# Altium schematic sheet MIRA016-CSP-Sheet1.SchDoc: MIRA016 CSP
size A3; Date: 15-Jun-2023; CheckedBy: -not-used-; Author: -not-used-; CompanyName: AMS; DrawnBy: -not-used-; Engineer: MKOC; Organization: AMS; Address1: Borsbeeksebrug 36; Address2: 2600 Antwerpen; Address3: Belgium; Address4: T: +32 3 260 1730 | F: +32 3 260 1779; Revision: 1.0; SheetNumber: 1; SheetTotal: 1; PageSetup: Record=PageOptions|CenterHorizontal=True|CenterVertical=True|PrintScale=0.71|XCorrection=1.00|YCorrection=1.00|PrintKind=0|BorderSize=5000000|LeftOffset=0|BottomOffset=0|Orientation=2|PaperLength=1000|PaperWidth=1000|Scale=100|PaperSource=7|PrintQuality=-4|MediaType=1|DitherType=10|PrintScaleMode=1|PaperKind=A4|PaperIndex=9; Comment1: Reference Design; Project: MIRA016; ProjectName: -not-used-; Rule: PcbType=ProtelPcb
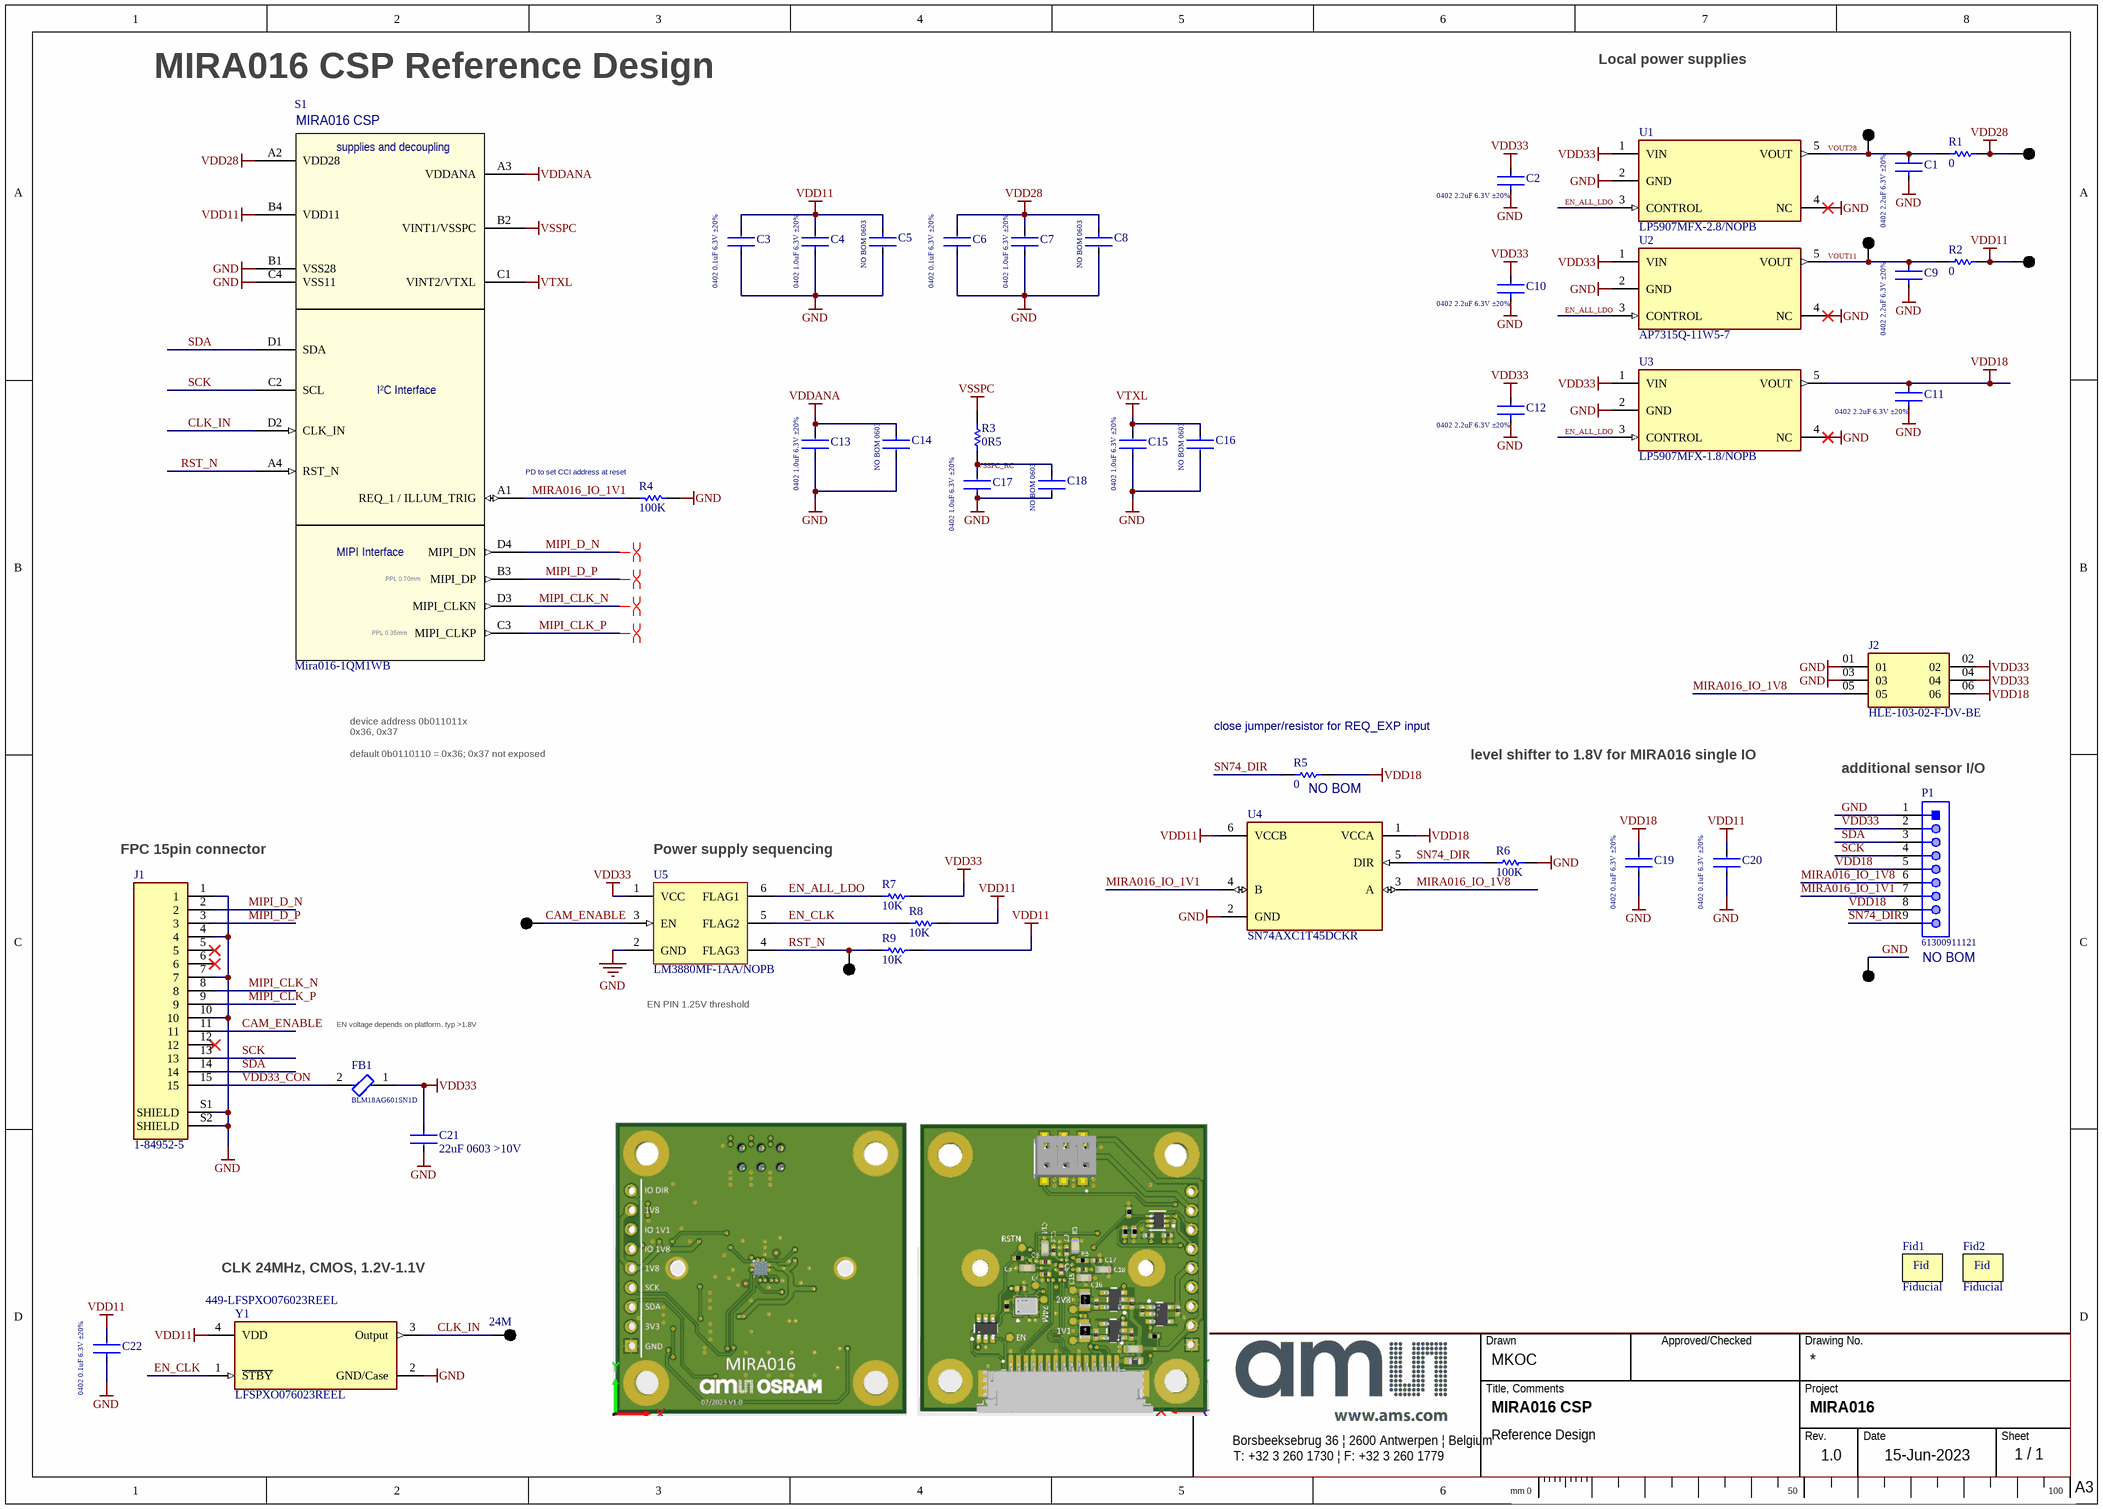
[diagram p0: MIRA016-CSP-Sheet1.SchDoc]

## Parts
C1  0402 2.2uF 6.3V ±20%  [CAPC0402_N]
C2  0402 2.2uF 6.3V ±20%  [CAPC0402_N]
C3  0402 0.1uF 6.3V ±20%  [CAPC0402_N]
C4  0402 1.0uF 6.3V ±20%  [CAPC0402_N]
C5  NO BOM 0603  [CAPC0603_L]  (no BOM)
C6  0402 0.1uF 6.3V ±20%  [CAPC0402_N]
C7  0402 1.0uF 6.3V ±20%  [CAPC0402_N]
C8  NO BOM 0603  [CAPC0603_L]  (no BOM)
C9  0402 2.2uF 6.3V ±20%  [CAPC0402_N]
C10  0402 2.2uF 6.3V ±20%  [CAPC0402_N]
C11  0402 2.2uF 6.3V ±20%  [CAPC0402_N]
C12  0402 2.2uF 6.3V ±20%  [CAPC0402_N]
C13  0402 1.0uF 6.3V ±20%  [CAPC0402_N]
C14  NO BOM 0603  [CAPC0603_L]  (no BOM)
C15  0402 1.0uF 6.3V ±20%  [CAPC0402_N]
C16  NO BOM 0603  [CAPC0603_L]  (no BOM)
C17  0402 1.0uF 6.3V ±20%  [CAPC0402_N]
C18  NO BOM 0603  [CAPC0603_L]  (no BOM)
C19  0402 0.1uF 6.3V ±20%  [CAPC0402_N]
C20  0402 0.1uF 6.3V ±20%  [CAPC0402_N]
C21  22uF 0603 >10V  [CAPC0603]
C22  0402 0.1uF 6.3V ±20%  [CAPC0402_N]
FB1  BLM18AG601SN1D  [FP-BLM18-0_15-t0_8-IPC_B]
Fid1  Fiducial  [Fiducial]  (no BOM)
Fid2  Fiducial  [Fiducial]  (no BOM)
J1  1-84952-5  [TE_1-84952-5]
J2  HLE-103-02-F-DV-BE  [SAMTEC_HLE-103-02-F-DV-BE]
P1  61300911121  [61300911121]  (no BOM)
R1  0  [RESC0805_N]
R2  0  [RESC0805_N]
R3  0R5  [RESC0402_N]
R4  100K  [RESC0402_N]
R5  0  [RESC0402_N]  (no BOM)
R6  100K  [RESC0402_N]
R7  10K  [RESC0402_N]
R8  10K  [RESC0402_N]
R9  10K  [RESC0402_N]
S1  Mira016-1QM1WB  [MIRA016CSP]
TP1  2V8  [TP_1mm]  (value not drawn)  (no BOM)
TP2  2V8  [TP_1mm]  (value not drawn)  (no BOM)
TP3  1V1  [TP_1mm]  (value not drawn)  (no BOM)
TP4  1V1  [TP_1mm]  (value not drawn)  (no BOM)
TP6  EN  [TP_1mm]  (value not drawn)  (no BOM)
TP7  RSTN  [TP_1mm]  (value not drawn)  (no BOM)
TP8  GND  [TP_1mm]  (value not drawn)  (no BOM)
TP9  24M  [TP_1mm]  (no BOM)
U1  LP5907MFX-2.8/NOPB  [FP-DBV0005A-MFG]
U2  AP7315Q-11W5-7  [FP-DBV0005A-MFG]
U3  LP5907MFX-1.8/NOPB  [FP-DBV0005A-MFG]
U4  SN74AXC1T45DCKR  [FP-DCK0006A-IPC_B]
U5  LM3880MF-1AA/NOPB  [DBV0006A_N]
Y1  LFSPXO076023REEL  Supplier Part Number 1: 449-LFSPXO076023REEL  [FP-ASE-MFG]

## Nets
GND: C1.1 C2.1 C3.1 C4.1 C5.2 C6.1 C7.1 C8.2 C9.1 C10.1 C11.1 C12.1 C13.1 C14.2 C15.1 C16.2 C17.1 C18.2 C19.1 C20.1 C21.2 C22.1 J1.1 J1.4 J1.7 J1.10 J1.S1(SHIELD) J1.S2(SHIELD) J2.01 J2.03 P1.1 R4.1 R6.1 S1.B1(VSS28) S1.C4(VSS11) TP8.1 U1.2(GND) U1.4(NC) U2.2(GND) U2.4(NC) U3.2(GND) U3.4(NC) U4.2(GND) U5.2(GND) Y1.2(GND/Case)
VDD11: C3.2 C4.2 C5.1 C20.2 C22.2 R2.1 R8.2 R9.2 S1.B4(VDD11) TP4.1 U4.6(VCCB) Y1.4(VDD)
VDD18: C11.2 C19.2 J2.06 P1.5 P1.8 R5.2 U3.5(VOUT) U4.1(VCCA)
VDD28: C6.2 C7.2 C8.1 R1.1 S1.A2(VDD28) TP2.1
VDD33: C2.2 C10.2 C12.2 C21.1 FB1.1 J2.02 J2.04 P1.2 R7.2 U1.1(VIN) U2.1(VIN) U3.1(VIN) U5.1(VCC)
VDDANA: C13.2 C14.1 S1.A3(VDDANA)
VSSPC: R3.2 S1.B2(VINT1/VSSPC)
VTXL: C15.2 C16.1 S1.C1(VINT2/VTXL)
CAM_ENABLE: J1.11 TP6.1 U5.3(EN)
CLK_IN: S1.D2(CLK_IN) TP9.1 Y1.3(Output)
EN_ALL_LDO: R7.1 U1.3(CONTROL) U2.3(CONTROL) U3.3(CONTROL) U5.6(FLAG1)
EN_CLK: R8.1 U5.5(FLAG2) Y1.1(~{STBY})
MIPI_CLK_N: J1.8 S1.D3(MIPI_CLKN)
MIPI_CLK_P: J1.9 S1.C3(MIPI_CLKP)
MIPI_D_N: J1.2 S1.D4(MIPI_DN)
MIPI_D_P: J1.3 S1.B3(MIPI_DP)
MIRA016_IO_1V1: P1.7 R4.2 S1.A1(REQ_1_/_ILLUM_TRIG) U4.4(B)
MIRA016_IO_1V8: J2.05 P1.6 U4.3(A)
RST_N: R9.1 S1.A4(RST_N) TP7.1 U5.4(FLAG3)
SCK: J1.13 P1.4 S1.C2(SCL)
SDA: J1.14 P1.3 S1.D1(SDA)
SN74_DIR: P1.9 R5.1 R6.2 U4.5(DIR)
VDD33_CON: FB1.2 J1.15
VOUT11: C9.2 R2.2 TP3.1 U2.5(VOUT)
VOUT28: C1.2 R1.2 TP1.1 U1.5(VOUT)
VSSPC_RC: C17.2 C18.1 R3.1

Not connected (* = marked no-connect by the designer): J1 5* 6* 12*

## Layout directives
differential pair: MIPI_CLK_N, MIPI_CLK_P, MIPI_D_N, MIPI_D_P

## Notes on the sheet
- MIRA016 CSP Reference Design
- Local power supplies
- (near R4) PD to set CCI address at reset
- device address 0b011011x
  0x36, 0x37
  default 0b0110110 = 0x36; 0x37 not exposed
- (near R5) close jumper/resistor for REQ_EXP input
- (near R5) NO BOM
- level shifter to 1.8V for MIRA016 single IO
- (near P1) additional sensor I/O
- (near J1) FPC 15pin connector
- (near U5) Power supply sequencing
- (near P1) NO BOM
- EN voltage depends on platform. typ >1.8V
- (near U5) EN PIN 1.25V threshold
- CLK 24MHz, CMOS, 1.2V-1.1V
- Title, Comments
- Drawn
- Approved/Checked
- Drawing No.
- Project
- Borsbeeksebrug 36 | 2600 Antwerpen | Belgium
- T: +32 3 260 1730 | F: +32 3 260 1779
- Rev.
- Date
- Sheet
- mm 0
- 50
- 100
- A3
- (in symbol Fiducial) Fid
- (in symbol MIRA016CSP) supplies and decoupling; I²C Interface; MIPI Interface; PPL 0.70mm; PPL 0.35mm

## Library data of the parts
C1 C2 C9-C12 = CAP0201: 0402 2.20uF 6.3V ±20%
C3 C4 C6 C7 C13 C15 C17 C19 C20 C22 = CAP0201
C5 C8 C14 C16 C18 = CAP0201: spare cap 0603; Case Code (Imperial): 0201; Case/Package: 0201
C21 = CAP0201: Chip Multilayer Ceramic Capacitors for General Purpose, 0603, 22uF, X5R, 15%, 10%, 25V; Case Code (Imperial): 0201; Case/Package: 0201
FB1 = CMP-0686-00436-3: Chip Ferrite Bead, 0603, 600Ω @ 100MHz, 0.38Ω, 25%, 500mA; Number of Lines: 1; Impedance: 600R; DC Resistance (DCR): 380mR; Material: Steel; Shielding: Unshielded; Max DC Current: 500mA; Termination: SMD/SMT; Military Standard: Not; Number of Circuits: 1; Min Operating Temperature: -55°C; Case Code (Imperial): 0603; Width: 0.8mm; Current Rating: 500mA; Lead Free: Lead Free; Packaging: Tape and Reel; Frequency: 100MHz; Max Operating Temperature: 125°C; DC Current: 500mA; REACH SVHC: No SVHC; Case/Package: 0603; Package Quantity: 1; Height: 0.8mm; Number of Pins: 2; Depth: 0.8mm; Test Frequency: 100MHz; Case Code (Metric): 1608; Tolerance: 25%; Core Material: Ferrite; Weight: 7.1E-05oz; Max Current Rating: 500mA; Radiation Hardening: No; Length: 1.6mm; RoHS Compliant: Yes
Fid1 Fid2 = Fiducial: Alignment feature for PCB Assembly; Part Number: NA; Designator: Fid?; Component: Fiducial; Componenttype: Fiducial
J1 = 1-84952-5: Conn FPC Connector SKT 15 POS 1mm Solder RA SMD T/R; Part Number: 1-84952-5
J2 = HLE-103-02-F-DV-BE: MF: Samtec; Value: *; Availability: Unavailable; Price: None; Package: None; MP: HLE-103-02-F-DV-BE
P1 = CMP-1502-01080-1: THT Vertical Pin Header WR-PHD, Pitch 2.54 mm, Single Row, 9 pins; Manufacturer: Wurth Elektronik; Pitch: 2.54mm; Gender: Male; Working Voltage: 250VAC; Contact Resistance: 20mOhm; Withstanding Voltage: 500VAC; Pin Number: 9; Rated Current: 3A; Package Reference: 61300911121; Part Number: 61300911121; Mounting Technology: THT; Publisher: WurthElektronik; Manufacturer URL: http://www.we-online.de; Orientation: Vertical; Datasheet URL: https://katalog.we-online.de/em/datasheet/6130xx11121.pdf; Operating Temperature: -40to105degC; Row Number: Single; Packaging: Bag
R1 R2 = ERJ2RKF1502X[[/\]]PANASONIC: Resistor 0R 0805
R3 = ERJ2RKF1502X[[/\]]PANASONIC: Resistor 0R5  0402
R4 R6 = ERJ2RKF1502X[[/\]]PANASONIC: Resistor 100K 0402; Component: 15K_±1%_0402_63mW_ERJ2RKF1502X; Value: 10K; Designator: R?; Tolerance: ±1%; Powerrating: 63mW; Voltagerating: 50V; Part Number: ERJ2RKF1502X; Componenttype: Resistor; Manufacturer: PANASONIC; Supplier Part Number 1: 2302754; Supplier 1: Farnell; Footprint: 0402
R5 = ERJ2RKF1502X[[/\]]PANASONIC: Resistor 0 0402; Component: 15K_±1%_0402_63mW_ERJ2RKF1502X; Designator: R?; Tolerance: ±1%; Powerrating: 63mW; Voltagerating: 50V; Part Number: ERJ2RKF1502X; Componenttype: Resistor; Value: 0; Manufacturer: PANASONIC; Supplier Part Number 1: 2302754; Supplier 1: Farnell; Footprint: 0402
R7-R9 = ERJ2RKF1502X[[/\]]PANASONIC: Resistor 10K 0402; Component: 15K_±1%_0402_63mW_ERJ2RKF1502X; Designator: R?; Tolerance: ±1%; Powerrating: 63mW; Voltagerating: 50V; Part Number: ERJ2RKF1502X; Componenttype: Resistor; Value: 10K; Manufacturer: PANASONIC; Supplier Part Number 1: 2302754; Supplier 1: Farnell; Footprint: 0402
S1 = MIRA016CSP: MIRA016 CSP
TP1-TP4 TP6-TP9 = 5001: Test Point, various footprints
U1-U3 = LDO-STO23-5: IC REG LINEAR fixed Voltage, SOT23-5 / SOT-25 / SC74A package; Mount: Surface Mount
U4 = CMP-04899-000070-1: IC TRNSLTR BIDIRECTIONAL SC70-6; Number of Bits: 1; Data Rate: 500Mbps; Channel Type: Bidirectional; Packaging: Tape and Reel; Number of Circuits: 1; Mount: Surface Mount; RoHS Compliant: Yes; Max Operating Temperature: 125°C; Min Operating Temperature: -40°C
U5 = CMP-0063-01015-4: Power Sequencer, 6-pin SOT-23, Pb-Free, 1000 Reel; Part Number: LM3880MF-1AA/NOPB
Y1 = CMP-2000-05795-3: Manufacturer: IQD; Frequency: 24MHz; Frequency Stability: 50ppm; Max Supply Current: 10mA; Supplier 1: Mouser; Manufacturer Part Number: LFSPXO076023REEL; RoHS: Yes; Category: Oscillators; Stock 1: 2945; Pricing 1: 1=2.69000, 10=2.51000, 50=2.51000, 100=2.19000, 1000=1.82000, 10000=1.82000 (USD); Mounting Technology: Surface Mount; Case/Package: SMD/SMT; Min Operating Temperature: -40°C; Max Operating Temperature: 85°C; Packaging: Cut Tape; RoHS Compliant: No; ComponentLink1URL: https://www.iqdfrequencyproducts.com/products/pn/LFSPXO076023Reel.pdf?src-supplier=Digi-Key; ComponentLink1Description: https://www.iqdfrequencyproducts.com/products/pn/LFSPXO076023Reel.pdf?src-supplier=Digi-Key